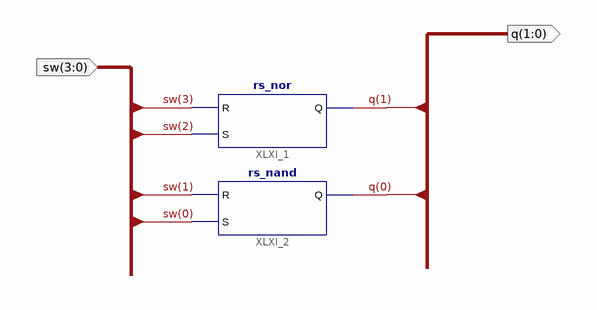
[diagram p0: schematic sheet 1]
// Xilinx ISE schematic main.sch (spartan6) as structural Verilog: 2 symbols, 2 ports
module main (
  input  [3:0] sw,
  output [1:0] q
);

  rs_nor XLXI_1 (.R(sw[3]), .S(sw[2]), .Q(q[1]));
  rs_nand XLXI_2 (.R(sw[1]), .S(sw[0]), .Q(q[0]));
endmodule
